# EAGLE schematic pcb10_13 (EAGLE 9.6.2)
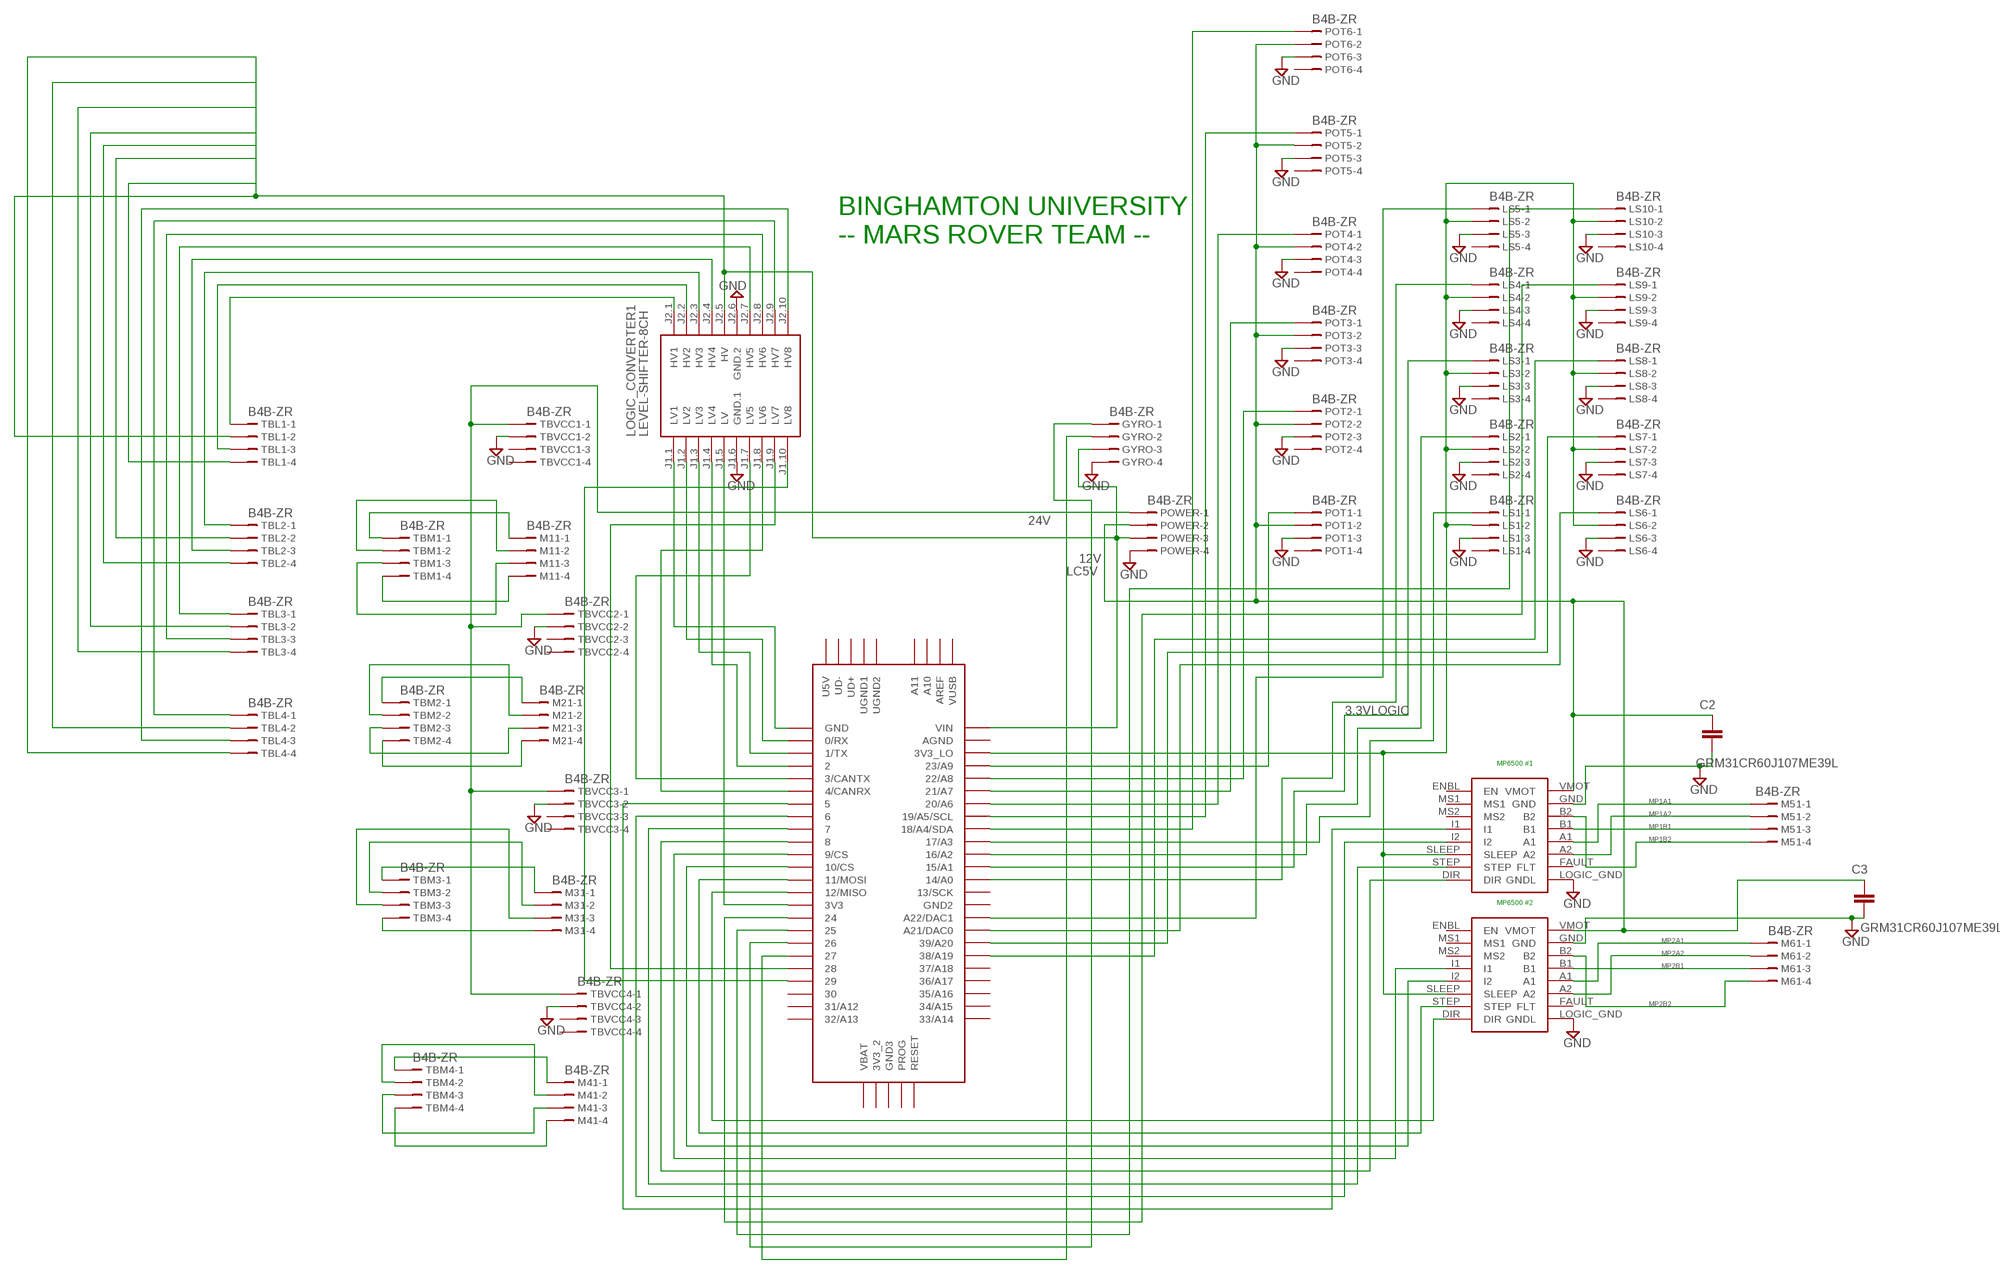
[diagram p0: schematic, sheet 1]

## Parts
C2  GRM31CR60J107ME39L  [CAP_1206]
C3  GRM31CR60J107ME39L  [CAP_1206]
GYRO  B4B-ZR  [B4B-ZR]
LOGIC_CONVERTER1  LEVEL-SHIFTER-8CH  [LEVEL-SHIFTER-8CH]
LS1  B4B-ZR  [B4B-ZR]
LS2  B4B-ZR  [B4B-ZR]
LS3  B4B-ZR  [B4B-ZR]
LS4  B4B-ZR  [B4B-ZR]
LS5  B4B-ZR  [B4B-ZR]
LS6  B4B-ZR  [B4B-ZR]
LS7  B4B-ZR  [B4B-ZR]
LS8  B4B-ZR  [B4B-ZR]
LS9  B4B-ZR  [B4B-ZR]
LS10  B4B-ZR  [B4B-ZR]
M11  B4B-ZR  [B4B-ZR]
M21  B4B-ZR  [B4B-ZR]
M31  B4B-ZR  [B4B-ZR]
M41  B4B-ZR  [B4B-ZR]
M51  B4B-ZR  [B4B-ZR]
M61  B4B-ZR  [B4B-ZR]
MP6500_3  MP6500THROUGH_HOLE  [MP6500]
MP6500_4  MP6500THROUGH_HOLE  [MP6500]
POT1  B4B-ZR  [B4B-ZR]
POT2  B4B-ZR  [B4B-ZR]
POT3  B4B-ZR  [B4B-ZR]
POT4  B4B-ZR  [B4B-ZR]
POT5  B4B-ZR  [B4B-ZR]
POT6  B4B-ZR  [B4B-ZR]
POWER  B4B-ZR  [B4B-ZR]
TBL1  B4B-ZR  [B4B-ZR]
TBL2  B4B-ZR  [B4B-ZR]
TBL3  B4B-ZR  [B4B-ZR]
TBL4  B4B-ZR  [B4B-ZR]
TBM1  B4B-ZR  [B4B-ZR]
TBM2  B4B-ZR  [B4B-ZR]
TBM3  B4B-ZR  [B4B-ZR]
TBM4  B4B-ZR  [B4B-ZR]
TBVCC1  B4B-ZR  [B4B-ZR]
TBVCC2  B4B-ZR  [B4B-ZR]
TBVCC3  B4B-ZR  [B4B-ZR]
TBVCC4  B4B-ZR  [B4B-ZR]
TEENSY4.2  TEENSY_3.5/3.6  [TEENSY_3.5/3.6]

## Nets
3.3VLOGIC: LS1.2 LS2.2 LS3.2 LS4.2 LS5.2 LS6.2 LS7.2 LS8.2 LS9.2 LS10.2 MP6500_3.SLEEP MP6500_4.SLEEP TEENSY4.2.3V3_LO
12V: C2.1 C3.1 MP6500_3.VMOT MP6500_4.VMOT POT1.2 POT2.2 POT3.2 POT4.2 POT5.2 POT6.2 POWER.2
24V: POWER.1 TBVCC1.1 TBVCC2.1 TBVCC3.1 TBVCC4.1
GND: C2.2 C3.2 GYRO.4 LOGIC_CONVERTER1.J1.6(GND.1) LOGIC_CONVERTER1.J2.6(GND.2) LS1.3 LS2.3 LS3.3 LS4.3 LS5.3 LS6.3 LS7.3 LS8.3 LS9.3 LS10.3 MP6500_3.GND MP6500_3.LOGIC_GND(GNDL) MP6500_4.GND MP6500_4.LOGIC_GND(GNDL) POT1.3 POT2.3 POT3.3 POT4.3 POT5.3 POT6.3 POWER.4 TBVCC1.2 TBVCC2.2 TBVCC3.2 TBVCC4.2
GYRO1: GYRO.1 TEENSY4.2.26
GYRO2: GYRO.2 TEENSY4.2.27
LC1CH1: LOGIC_CONVERTER1.J2.1(HV1) TBL1.1
LC1CH2: LOGIC_CONVERTER1.J2.2(HV2) TBL1.3
LC1CH3: LOGIC_CONVERTER1.J2.3(HV3) TBL2.1
LC1CH4: LOGIC_CONVERTER1.J2.4(HV4) TBL2.3
LC1CH5: LOGIC_CONVERTER1.J2.7(HV5) TBL3.1
LC1CH6: LOGIC_CONVERTER1.J2.8(HV6) TBL3.3
LC1CH7: LOGIC_CONVERTER1.J2.9(HV7) TBL4.1
LC1CH8: LOGIC_CONVERTER1.J2.10(HV8) TBL4.3
LC2CH1: LOGIC_CONVERTER1.J1.1(LV1) TEENSY4.2.GND
LC2CH2: LOGIC_CONVERTER1.J1.2(LV2) TEENSY4.2.0/RX
LC2CH3: LOGIC_CONVERTER1.J1.3(LV3) TEENSY4.2.1/TX
LC2CH4: LOGIC_CONVERTER1.J1.4(LV4) TEENSY4.2.2
LC2CH5: LOGIC_CONVERTER1.J1.7(LV5) TEENSY4.2.3/CANTX
LC2CH6: LOGIC_CONVERTER1.J1.8(LV6) TEENSY4.2.4/CANRX
LC2CH7: LOGIC_CONVERTER1.J1.9(LV7) TEENSY4.2.28
LC2CH8: LOGIC_CONVERTER1.J1.10(LV8) TEENSY4.2.29
LC3.3V: LOGIC_CONVERTER1.J1.5(LV) TEENSY4.2.3V3
LC5V: GYRO.3 LOGIC_CONVERTER1.J2.5(HV) POWER.3 TBL1.2 TBL1.4 TBL2.2 TBL2.4 TBL3.2 TBL3.4 TBL4.2 TBL4.4 TEENSY4.2.VIN
LS1-1OUT: LS1.1 TEENSY4.2.17/A3
LS2-1OUT: LS2.1 TEENSY4.2.16/A2
LS3-1OUT: LS3.1 TEENSY4.2.15/A1
LS4-1OUT: LS4.1 TEENSY4.2.14/A0
LS5-1OUT: LS5.1 TEENSY4.2.A22/DAC1
LS6-1OUT: LS6.1 TEENSY4.2.21/DAC0(A21/DAC0)
LS7-1OUT: LS7.1 TEENSY4.2.39/A20
LS8-1OUT: LS8.1 TEENSY4.2.38/A19
LS9-1OUT: LS9.1 TEENSY4.2.24
LS10-1OUT: LS10.1 TEENSY4.2.25
MP1-I1: MP6500_3.I1 TEENSY4.2.5
MP1-I2: MP6500_3.I2 TEENSY4.2.6
MP1A1: M51.1 MP6500_3.A1
MP1A2: M51.2 MP6500_3.A2
MP1B1: M51.3 MP6500_3.B1
MP1B2: M51.4 MP6500_3.B2
MP1DIR: MP6500_3.DIR TEENSY4.2.8
MP1STEP: MP6500_3.STEP TEENSY4.2.7
MP2-I1: MP6500_4.I1 TEENSY4.2.9/CS
MP2-I2: MP6500_4.I2 TEENSY4.2.10/CS
MP2A1: M61.1 MP6500_4.A1
MP2A2: M61.2 MP6500_4.A2
MP2B1: M61.3 MP6500_4.B1
MP2B2: M61.4 MP6500_4.B2
MP2DIR: MP6500_4.DIR TEENSY4.2.12/MISO
MP2STEP: MP6500_4.STEP TEENSY4.2.11/MOSI
POT1-1OUT: POT1.1 TEENSY4.2.23/A9
POT2-1OUT: POT2.1 TEENSY4.2.22/A8
POT3-1OUT: POT3.1 TEENSY4.2.21/A7
POT4-1OUT: POT4.1 TEENSY4.2.20/A6
POT5-1OUT: POT5.1 TEENSY4.2.19/A5/SCL
POT6-1OUT: POT6.1 TEENSY4.2.18/A4/SDA
TBM1-1OUT: M11.1 TBM1.1
TBM1-2OUT: M11.2 TBM1.2
TBM1-3OUT: M11.3 TBM1.3
TBM1-4OUT: M11.4 TBM1.4
TBM2-1OUT: M21.1 TBM2.1
TBM2-2OUT: M21.2 TBM2.2
TBM2-3OUT: M21.3 TBM2.3
TBM2-4OUT: M21.4 TBM2.4
TBM3-1OUT: M31.1 TBM3.1
TBM3-2OUT: M31.2 TBM3.2
TBM3-3OUT: M31.3 TBM3.3
TBM3-4OUT: M31.4 TBM3.4
TBM4-1OUT: M41.1 TBM4.1
TBM4-2OUT: M41.2 TBM4.2
TBM4-3OUT: M41.3 TBM4.3
TBM4-4OUT: M41.4 TBM4.4
Unconnected: LS1.4 LS2.4 LS3.4 LS4.4 LS5.4 LS6.4 LS7.4 LS8.4 LS9.4 LS10.4 MP6500_3.ENBL(EN) MP6500_3.FAULT(FLT) MP6500_3.MS1 MP6500_3.MS2 MP6500_4.ENBL(EN) MP6500_4.FAULT(FLT) MP6500_4.MS1 MP6500_4.MS2 POT1.4 POT2.4 POT3.4 POT4.4 POT5.4 POT6.4 TBVCC1.3 TBVCC1.4 TBVCC2.3 TBVCC2.4 TBVCC3.3 TBVCC3.4 TBVCC4.3 TBVCC4.4 TEENSY4.2.3V3_2 TEENSY4.2.13/SCK TEENSY4.2.30 TEENSY4.2.31/A12 TEENSY4.2.32/A13 TEENSY4.2.33/A14 TEENSY4.2.34/A15 TEENSY4.2.35/A16 TEENSY4.2.36/A17 TEENSY4.2.37/A18 TEENSY4.2.A10 TEENSY4.2.A11 TEENSY4.2.AGND TEENSY4.2.AREF TEENSY4.2.GND2 TEENSY4.2.GND3 TEENSY4.2.PROG TEENSY4.2.RESET TEENSY4.2.U5V TEENSY4.2.UD+ TEENSY4.2.UD- TEENSY4.2.UGND1 TEENSY4.2.UGND2 TEENSY4.2.VBAT TEENSY4.2.VUSB

## Notes on the sheet
- BINGHAMTON UNIVERSITY
  -- MARS ROVER TEAM --
- MP6500 #1
- MP6500 #2

## Library data of the parts
C2 C3 = Resistor_Capacitor:GRM31CR60J107ME39L: CAP CER 100UF 6.3V X5R 1206 Manufacturer's datasheet <https://www.murata.com/~/media/webrenewal/support/library/catalog/products/capacitor/mlcc/c02e.ashx?la=en-us>; CREATED_BY: PCBLayout.com; DIGIKEY_PART_NUMBER: GRM31CR60J107ME39L; MANUFACTURER: Murata Electronics North America; MPN: GRM31CR60J107ME39L; PACKAGE: SMD 1206
GYRO LS1-LS10 M11 M21 M31 M41 M51 M61 POT1-POT6 POWER TBL1-TBL4 TBM1-TBM4 TBVCC1-TBVCC4 = con-jst:?4B-ZR: ZH CONNECTOR 1.5 mm, 4 pin 1 row Source: http://www.jst.com .. eZH.pdf; MF: FARNELL; MPN: B4B-ZR(LF)(SN); OC_FARNELL: 1830916; OC_NEWARK: 37K9960
LOGIC_CONVERTER1 = diy-modules:LEVEL-SHIFTER-8CH: 8-Channel Bi-Directional Logic Level Converter based on BSS128 transistors Click here to find device on ebay.com <http://www.ebay.com/sch/8+channel+level+converter> Note: There are many variants. Search for the proper version.
MP6500_3 MP6500_4 = MP6500:MP6500
TEENSY4.2 = Teensy356:TEENSY_3.5/3.6

## Net classes
0 default: width 0.305 mm, drill 0.279 mm